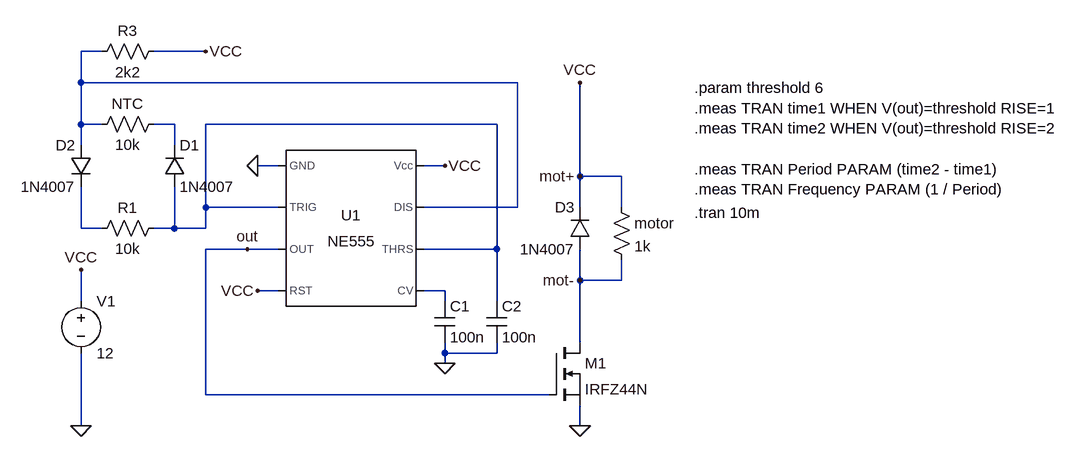
[diagram p0: schematic FanSpeedControl.asc]
FanSpeedControl.asc, the LTspice schematic file:
Version 4
SHEET 1 1352 680
WIRE -160 -80 -192 -80
WIRE 0 -80 -80 -80
WIRE -192 -32 -192 -80
WIRE 480 -32 -192 -32
WIRE -192 32 -192 -32
WIRE -160 32 -192 32
WIRE -48 32 -80 32
WIRE 448 32 0 32
WIRE -192 64 -192 32
WIRE -48 64 -48 32
WIRE 112 96 80 96
WIRE 368 96 336 96
WIRE 576 112 576 -32
WIRE 640 112 576 112
WIRE 0 160 0 32
WIRE 112 160 0 160
WIRE 480 160 480 -32
WIRE 480 160 336 160
WIRE 576 160 576 112
WIRE 640 160 640 112
WIRE -192 192 -192 128
WIRE -160 192 -192 192
WIRE -48 192 -48 128
WIRE -48 192 -80 192
WIRE 0 192 0 160
WIRE 0 192 -48 192
WIRE 64 224 0 224
WIRE 112 224 64 224
WIRE 448 224 448 32
WIRE 448 224 336 224
WIRE 576 272 576 224
WIRE 640 272 640 240
WIRE 640 272 576 272
WIRE 112 288 80 288
WIRE 368 288 336 288
WIRE -192 304 -192 256
WIRE 368 304 368 288
WIRE 448 304 448 224
WIRE 576 368 576 272
WIRE 368 384 368 368
WIRE 448 384 448 368
WIRE 448 384 368 384
WIRE 368 400 368 384
WIRE 0 448 0 224
WIRE 528 448 0 448
WIRE -192 496 -192 384
WIRE 576 496 576 464
FLAG 368 400 0
FLAG 80 96 0
FLAG 80 288 VCC
FLAG 368 96 VCC
FLAG 576 496 0
FLAG 0 -80 VCC
FLAG 576 -32 VCC
FLAG -192 496 0
FLAG -192 256 VCC
FLAG 64 224 out
FLAG 576 272 mot-
FLAG 576 112 mot+
SYMBOL Misc\\NE555 224 192 R0
SYMATTR InstName U1
SYMBOL cap 352 304 R0
SYMATTR InstName C1
SYMATTR Value 100n
SYMBOL cap 432 304 R0
SYMATTR InstName C2
SYMATTR Value 100n
SYMBOL nmos 528 368 R0
SYMATTR InstName M1
SYMATTR Value IRFZ44N
SYMBOL diode -64 128 M180
WINDOW 0 24 64 Left 2
WINDOW 3 24 0 Left 2
SYMATTR InstName D1
SYMATTR Value 1N4007
SYMBOL diode -176 64 M0
SYMATTR InstName D2
SYMATTR Value 1N4007
SYMBOL res -64 176 R90
WINDOW 0 0 56 VBottom 2
WINDOW 3 32 56 VTop 2
SYMATTR InstName R1
SYMATTR Value 10k
SYMBOL res -64 16 R90
WINDOW 0 0 56 VBottom 2
WINDOW 3 32 56 VTop 2
SYMATTR InstName NTC
SYMATTR Value 10k
SYMBOL res -64 -96 R90
WINDOW 0 0 56 VBottom 2
WINDOW 3 32 56 VTop 2
SYMATTR InstName R3
SYMATTR Value 2k2
SYMBOL diode 592 224 R180
WINDOW 0 24 64 Left 2
WINDOW 3 24 0 Left 2
SYMATTR InstName D3
SYMATTR Value 1N4007
SYMBOL res 624 144 R0
SYMATTR InstName motor
SYMATTR Value 1k
SYMBOL voltage -192 288 R0
SYMATTR InstName V1
SYMATTR Value 12
TEXT 752 -24 Left 2 !.param threshold 6\n.meas TRAN time1 WHEN V(out)=threshold RISE=1\n.meas TRAN time2 WHEN V(out)=threshold RISE=2\n \n.meas TRAN Period PARAM (time2 - time1)\n.meas TRAN Frequency PARAM (1 / Period)
TEXT 752 168 Left 2 !.tran 10m

The netlist it stands for:
* FanSpeedControl.asc
XU1 0 N003 out mot+ N005 N003 N001 mot+ NE555  ; pins GND TRIG OUT RST CV THRS DIS Vcc
C1 N005 0 100n
C2 N003 0 100n
M1 mot- out 0 0 IRFZ44N
D1 N003 N002 1N4007
D2 N001 N004 1N4007
R1 N003 N004 10k
R§NTC N002 N001 10k
R3 mot+ N001 2k2
D3 mot- mot+ 1N4007
R§motor mot+ mot- 1k
V1 mot+ 0 12
.model D D
.lib standard.dio
.model NMOS NMOS
.model PMOS PMOS
.lib standard.mos
.param threshold 6
.meas TRAN time1 WHEN V(out)=threshold RISE=1
.meas TRAN time2 WHEN V(out)=threshold RISE=2
.meas TRAN Period PARAM (time2 - time1)
.meas TRAN Frequency PARAM (1 / Period)
.tran 10m
.lib NE555.sub
.backanno
.end